# EAGLE design Serial Card V2 (EAGLE 6.5.0)
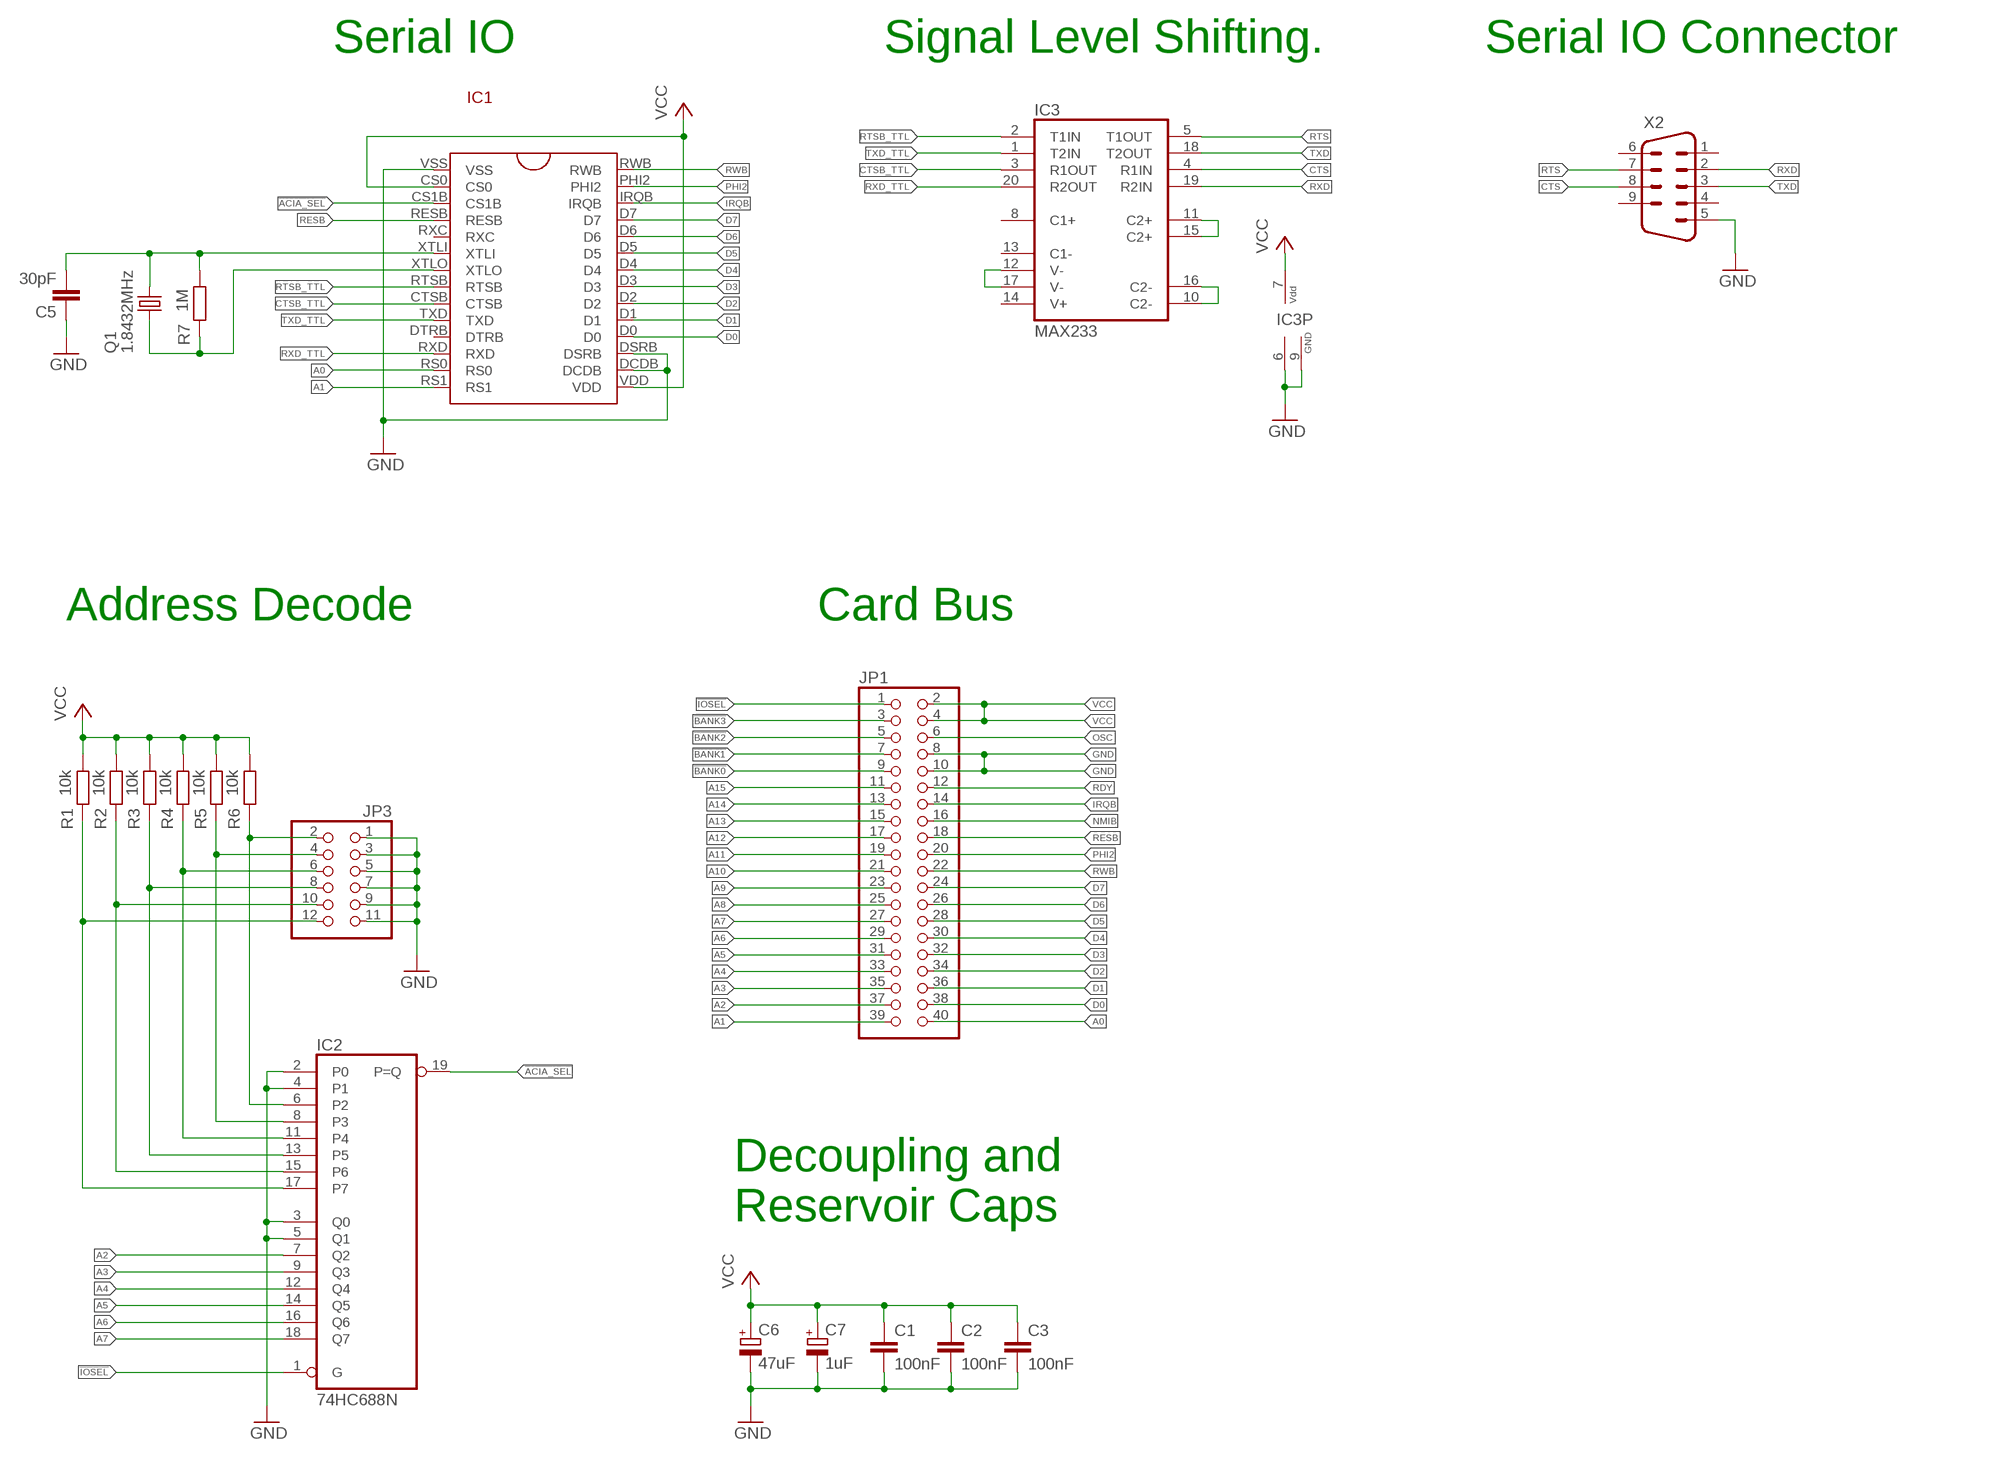
[diagram p0: schematic, sheet 1]

## Parts
C1  100nF  C-EU050-025X075  [C050-025X075]
C2  100nF  C-EU050-025X075  [C050-025X075]
C3  100nF  C-EU050-025X075  [C050-025X075]
C5  30pF  C-EU050-025X075  [C050-025X075]
C6  47uF  CPOL-EUE2.5-7  [E2,5-7]
C7  1uF  CPOL-EUE2.5-5  [E2,5-5]
IC1  W65C51N-DIP  [W65C51N-DIP]
IC2  74HC688N  [DIL20]
IC3  MAX233  [DIL20]
JP1  PINHD-2X20/90  [2X20/90]
JP3  PINHD-2X6  [2X06]
Q1  1.8432MHz  CRYSTALHC49S  [HC49/S]
R1  10k  R-EU_0207/2V  [0207/2V]
R2  10k  R-EU_0207/2V  [0207/2V]
R3  10k  R-EU_0207/2V  [0207/2V]
R4  10k  R-EU_0207/2V  [0207/2V]
R5  10k  R-EU_0207/2V  [0207/2V]
R6  10k  R-EU_0207/2V  [0207/2V]
R7  1M  R-EU_0207/2V  [0207/2V]
X2  M09HP  [M09HP]

## Nets
!ACIA_SEL: IC1.CS1B IC2.19(P=Q)
!BANK0: JP1.9
!BANK1: JP1.7
!BANK2: JP1.5
!BANK3: JP1.3
!IOSEL: IC2.1(G) JP1.1
A0: IC1.RS0 JP1.40
A1: IC1.RS1 JP1.39
A2: IC2.7(Q2) JP1.37
A3: IC2.9(Q3) JP1.35
A4: IC2.12(Q4) JP1.33
A5: IC2.14(Q5) JP1.31
A6: IC2.16(Q6) JP1.29
A7: IC2.18(Q7) JP1.27
A8: JP1.25
A9: JP1.23
A10: JP1.21
A11: JP1.19
A12: JP1.17
A13: JP1.15
A14: JP1.13
A15: JP1.11
CTS: IC3.4(R1IN) X2.8
CTSB_TTL: IC1.CTSB IC3.3(R1OUT)
D0: IC1.D0 JP1.38
D1: IC1.D1 JP1.36
D2: IC1.D2 JP1.34
D3: IC1.D3 JP1.32
D4: IC1.D4 JP1.30
D5: IC1.D5 JP1.28
D6: IC1.D6 JP1.26
D7: IC1.D7 JP1.24
GND: C1.2 C2.2 C3.2 C5.1 C6.- C7.- IC1.DCDB IC1.DSRB IC1.VSS IC2.2(P0) IC2.3(Q0) IC2.4(P1) IC2.5(Q1) IC3.6(GND) IC3.9(GND) JP1.8 JP1.10 JP3.1 JP3.3 JP3.5 JP3.7 JP3.9 JP3.11 X2.5
IRQB: IC1.IRQB JP1.14
N$1: C5.2 IC1.XTLI Q1.2 R7.2
N$2: IC1.XTLO Q1.1 R7.1
N$5: IC3.12(V-) IC3.17(V-)
N$8: IC3.11(C2+) IC3.15(C2+)
N$9: IC3.10(C2-) IC3.16(C2-)
NMIB: JP1.16
OSC: JP1.6
P2: IC2.6(P2) JP3.2 R6.1
P3: IC2.8(P3) JP3.4 R5.1
P4: IC2.11(P4) JP3.6 R4.1
P5: IC2.13(P5) JP3.8 R3.1
P6: IC2.15(P6) JP3.10 R2.1
P7: IC2.17(P7) JP3.12 R1.1
PHI2: IC1.PHI2 JP1.20
RDY: JP1.12
RESB: IC1.RESB JP1.18
RTS: IC3.5(T1OUT) X2.7
RTSB_TTL: IC1.RTSB IC3.2(T1IN)
RWB: IC1.RWB JP1.22
RXD: IC3.19(R2IN) X2.2
RXD_TTL: IC1.RXD IC3.20(R2OUT)
TXD: IC3.18(T2OUT) X2.3
TXD_TTL: IC1.TXD IC3.1(T2IN)
VCC: C1.1 C2.1 C3.1 C6.+ C7.+ IC1.CS0 IC1.VDD IC3.7(VDD) JP1.2 JP1.4 R1.2 R2.2 R3.2 R4.2 R5.2 R6.2
Unconnected: IC1.DTRB IC1.RXC IC3.8(C1+) IC3.13(C1-) IC3.14(V+) X2.1 X2.4 X2.6 X2.9

## Notes on the sheet
- Serial IO | Signal Level Shifting. | Serial IO Connector
- Address Decode | Card Bus
- Decoupling and
  Reservoir Caps

## Power pins joined to a net without a drawn wire
GND: IC2.10(GND)
VCC: IC2.20(VCC)

## Library data of the parts
C1-C3 C5 = rcl:C-EU: CAPACITOR, European symbol
C6 C7 = rcl:CPOL-EU: POLARIZED CAPACITOR, European symbol
IC1 = WDC-parts:W65C51N-DIP: Asynchronous Communications Interface Adaptor.
IC2 = 74xx-eu:74*688: 8-bit MAGNITUDE/IDENTITY COMPARATOR, totem pole
IC3 = maxim:MAX233: RS232 TRANSEIVER
JP1 = pinhead:PINHD-2X20: PIN HEADER
JP3 = pinhead:PINHD-2X6: PIN HEADER
Q1 = crystal:CRYSTAL: CRYSTAL; OC_FARNELL: 1667008; OC_NEWARK: unknown
R1-R7 = rcl:R-EU_: RESISTOR, European symbol
X2 = con-subd:M09: SUB-D; OC_FARNELL: unknown; OC_NEWARK: unknown

## Board
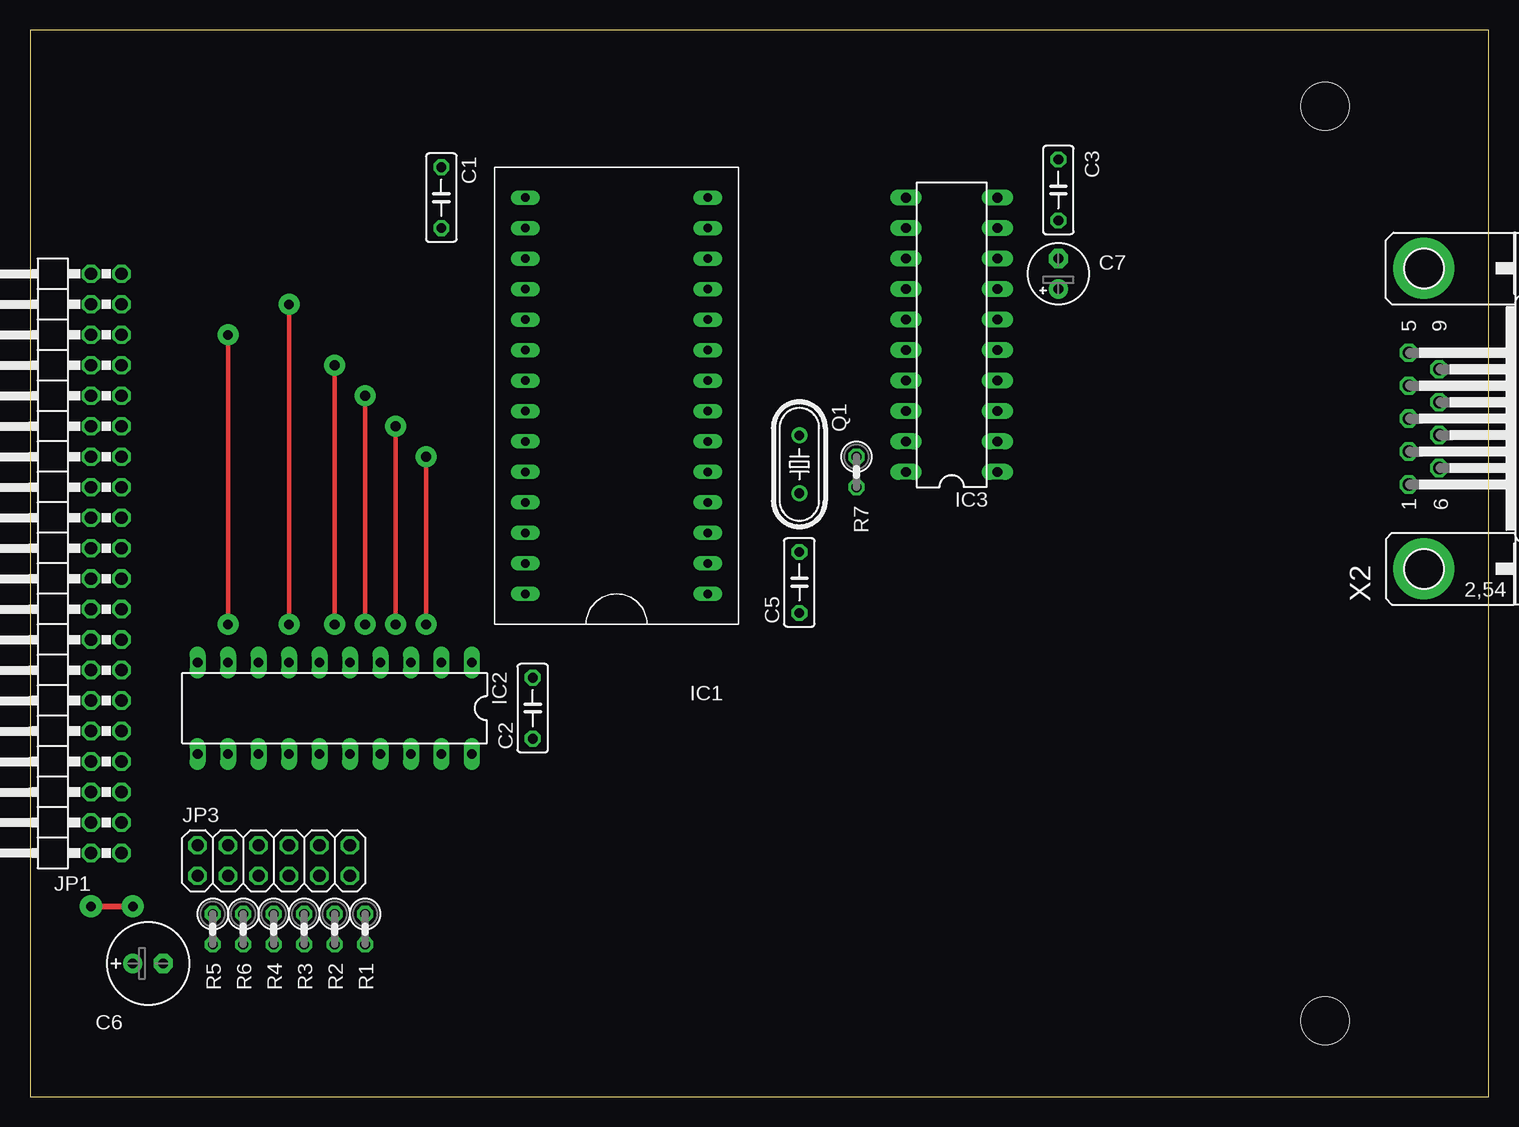
[diagram p1: board, top side]
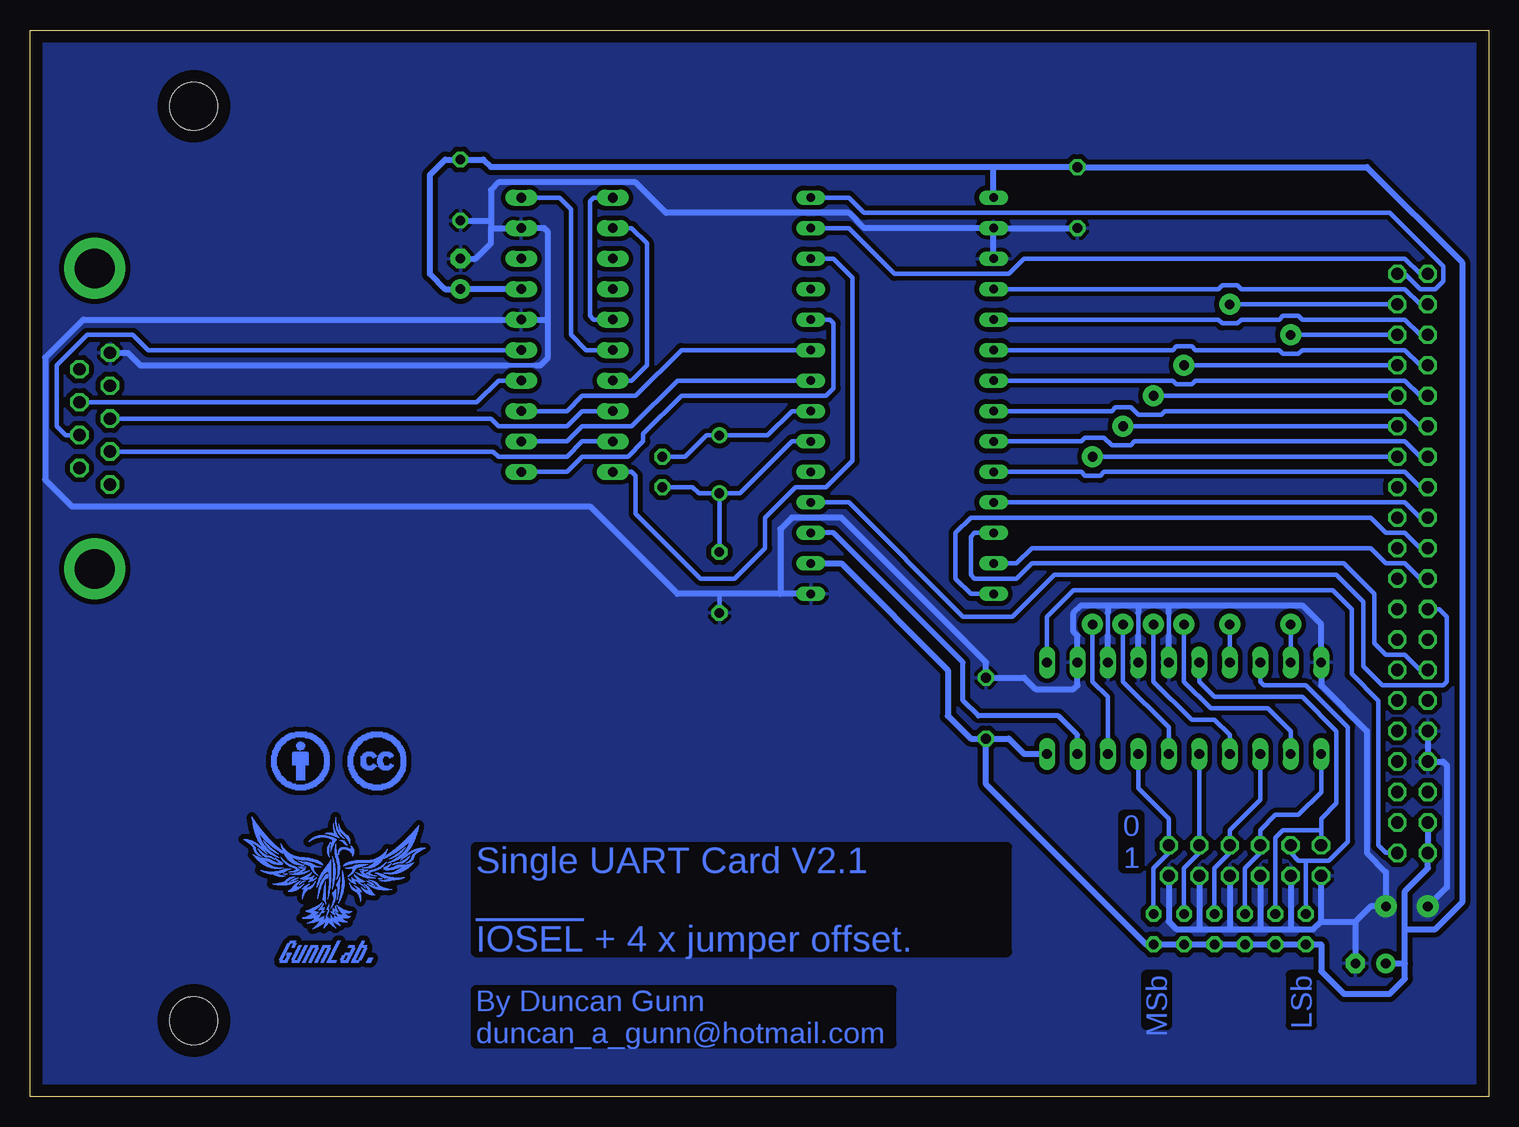
[diagram p2: board, bottom side, seen from below]

Size 121.6 x 88.9 mm. Coordinates in mm from the lower left corner, seen from the top.
Outline: 121.59,0 0,0 0,88.89 121.59,88.89
Outline: 121.6,0 121.6,88.9
Copper layers (1*16): Top 0.035mm / dielectric 1.5mm / Bottom 0.035mm
Design rules "default *": minimum track width 10mil, minimum drill 24mil, track to track 8mil, track to pad 8mil, pad to pad 8mil, via to via 8mil, smd to smd 8mil, copper to edge 40mil, drill to drill 8mil, minimum pad ring 10mil, minimum via ring 8mil, stop-mask expansion 4mil, vias tented up to drill 0mil, thermal gap 12mil
Holes 4 mm at 107.95,82.55 107.95,6.35

### Footprints (pad centres in the part's own frame; a part is rotated, then mirrored left to right if it is on the bottom)
C050-025X075 = drill 0.813 octagon: 1 -2.54,0; 2 2.54,0
E2,5-7 = drill 0.813 pad 1.6: + -1.27,0 | drill 0.813 pad 1.6 octagon: - 1.27,0
E2,5-5 = drill 0.813 pad 1.6: + -1.27,0 | drill 0.813 pad 1.6 octagon: - 1.27,0
W65C51N-DIP = drill 0.7 long: CS0 -7.62,13.97; CS1B -7.62,11.43; CTSB -7.62,-3.81; D0 7.62,-8.89; D1 7.62,-6.35; D2 7.62,-3.81; D3 7.62,-1.27; D4 7.62,1.27; D5 7.62,3.81; D6 7.62,6.35; D7 7.62,8.89; DCDB 7.62,-13.97; DSRB 7.62,-11.43; DTRB -7.62,-8.89; IRQB 7.62,11.43; PHI2 7.62,13.97; RESB -7.62,8.89; RS0 -7.62,-13.97; RS1 -7.62,-16.51; RTSB -7.62,-1.27; RWB 7.62,16.51; RXC -7.62,6.35; RXD -7.62,-11.43; TXD -7.62,-6.35; VDD 7.62,-16.51; VSS -7.62,16.51; XTLI -7.62,3.81; XTLO -7.62,1.27
DIL20 = drill 0.813 long: 1 -11.43,-3.81; 2 -8.89,-3.81; 3 -6.35,-3.81; 4 -3.81,-3.81; 5 -1.27,-3.81; 6 1.27,-3.81; 7 3.81,-3.81; 8 6.35,-3.81; 9 8.89,-3.81; 10 11.43,-3.81; 11 11.43,3.81; 12 8.89,3.81; 13 6.35,3.81; 14 3.81,3.81; 15 1.27,3.81; 16 -1.27,3.81; 17 -3.81,3.81; 18 -6.35,3.81; 19 -8.89,3.81; 20 -11.43,3.81
2X20/90 = drill 1.016 octagon: 1 -24.13,-6.35; 2 -24.13,-3.81; 3 -21.59,-6.35; 4 -21.59,-3.81; 5 -19.05,-6.35; 6 -19.05,-3.81; 7 -16.51,-6.35; 8 -16.51,-3.81; 9 -13.97,-6.35; 10 -13.97,-3.81; 11 -11.43,-6.35; 12 -11.43,-3.81; 13 -8.89,-6.35; 14 -8.89,-3.81; 15 -6.35,-6.35; 16 -6.35,-3.81; 17 -3.81,-6.35; 18 -3.81,-3.81; 19 -1.27,-6.35; 20 -1.27,-3.81; 21 1.27,-6.35; 22 1.27,-3.81; 23 3.81,-6.35; 24 3.81,-3.81; 25 6.35,-6.35; 26 6.35,-3.81; 27 8.89,-6.35; 28 8.89,-3.81; 29 11.43,-6.35; 30 11.43,-3.81; 31 13.97,-6.35; 32 13.97,-3.81; 33 16.51,-6.35; 34 16.51,-3.81; 35 19.05,-6.35; 36 19.05,-3.81; 37 21.59,-6.35; 38 21.59,-3.81; 39 24.13,-6.35; 40 24.13,-3.81
2X06 = drill 1.016 octagon: 1 -6.35,-1.27; 2 -6.35,1.27; 3 -3.81,-1.27; 4 -3.81,1.27; 5 -1.27,-1.27; 6 -1.27,1.27; 7 1.27,-1.27; 8 1.27,1.27; 9 3.81,-1.27; 10 3.81,1.27; 11 6.35,-1.27; 12 6.35,1.27
HC49/S = drill 0.813: 1 -2.413,0; 2 2.413,0
0207/2V = drill 0.813 octagon: 1 -1.27,0; 2 1.27,0
M09HP = drill 1.016 octagon: 1 -5.486,1.27; 2 -2.743,1.27; 3 0,1.27; 4 2.743,1.27; 5 5.486,1.27; 6 -4.115,-1.27; 7 -1.372,-1.27; 8 1.372,-1.27; 9 4.115,-1.27 | drill 3.302 pad 5.08: G1 -12.522,0; G2 12.522,0

### Placement (x,y rotation side)
C1  34.29,74.93 270 top
C2  41.91,32.38 90 top
C3  85.72,75.56 270 top
C5  64.14,42.86 90 top
C6  9.84,11.11 0 top
C7  85.72,68.58 90 top
IC1  48.9,58.42 180 top
IC2  25.4,32.38 180 top
IC3  76.83,63.5 90 top
JP1  1.27,44.45 90 top
JP3  20.32,19.68 0 top
Q1  64.14,52.7 270 top
R1  27.94,13.97 270 top
R2  25.4,13.97 270 top
R3  22.86,13.97 270 top
R4  20.32,13.97 270 top
R5  15.24,13.97 270 top
R6  17.78,13.97 270 top
R7  68.9,52.07 270 top
U$1  [LIONTECH]  96.52,17.78 0 top
U$2  [BY]  99.06,27.94 0 top
U$3  [CC]  92.71,27.94 180 top
X2  116.2,56.52 90 top

### Tracks (layer width: path | path; a pad name or v marks a point on that pad's centre or on a via)
!ACIA_SEL
  Bottom 0.406: IC2.19 34.29,30.16 35.88,31.75 42.55,31.75 43.81,33.02 43.81,36.2 54.61,46.99 IC1.CS1B
!IOSEL
  Bottom 0.356: IC2.1 36.83,40.01 34.61,42.23 13.02,42.23 11.43,40.64 11.43,35.24 9.21,33.02 9.21,20.95 8.57,20.32 JP1.1
A0
  Bottom 0.356: JP1.40 5.71,68.58 6.99,69.85 38.73,69.85 40.01,68.58 49.53,68.58 53.34,72.39 IC1.RS0
A1
  Bottom 0.356: JP1.39 6.99,68.58 5.71,67.31 4.45,67.31 3.81,67.94 3.81,69.22 8.26,73.66 52.07,73.66 53.34,74.93 IC1.RS1
A2  (via drill 0.8 pad 1.75)
  Top 0.356: v21.59,39.37 v21.59,66.04
  Bottom 0.356: IC2.7 v21.59,39.37 | v21.59,66.04 JP1.37
A3  (via drill 0.8 pad 1.75)
  Top 0.356: v16.51,39.37 v16.51,63.5
  Bottom 0.356: IC2.9 v16.51,39.37 | v16.51,63.5 JP1.35
A4  (via drill 0.8 pad 1.75)
  Top 0.356: v25.4,39.37 v25.4,60.96
  Bottom 0.356: IC2.12 16.51,30.48 18.41,32.38 23.18,32.38 25.4,34.61 v25.4,39.37 | v25.4,60.96 JP1.33
A5  (via drill 0.8 pad 1.75)
  Top 0.356: v27.94,39.37 v27.94,58.42
  Bottom 0.356: IC2.14 21.59,30.16 22.86,31.43 24.77,31.43 27.94,34.61 v27.94,39.37 | v27.94,58.42 JP1.31
A6  (via drill 0.8 pad 1.75)
  Top 0.356: v30.48,39.37 v30.48,55.88
  Bottom 0.356: IC2.16 26.67,30.8 30.48,34.61 v30.48,39.37 | v30.48,55.88 JP1.29
A7  (via drill 0.8 pad 1.75)
  Top 0.356: v33.02,39.37 v33.02,53.34
  Bottom 0.356: IC2.18 31.75,33.34 33.02,34.61 v33.02,39.37 | v33.02,53.34 JP1.27
CTS
  Bottom 0.356: X2.8 84.35,57.89 82.55,59.69 IC3.4
CTSB_TTL
  Bottom 0.356: IC3.3 76.83,57.15 75.56,58.42 71.12,58.42 67.31,62.23 IC1.CTSB
D0
  Bottom 0.356: JP1.38 5.71,66.04 6.99,67.31 20.64,67.31 20.95,67.63 22.23,67.63 22.54,67.31 IC1.D0
D1
  Bottom 0.356: JP1.36 5.71,63.5 6.99,64.77 15.56,64.77 15.88,65.09 17.14,65.09 17.46,64.77 20.64,64.77 20.95,64.45 22.23,64.45 22.54,64.77 IC1.D1
D2
  Bottom 0.356: JP1.34 5.71,60.96 6.99,62.23 15.56,62.23 15.88,61.91 17.14,61.91 17.46,62.23 24.45,62.23 24.77,62.55 26.04,62.55 26.35,62.23 IC1.D2
D3
  Bottom 0.356: JP1.32 5.71,58.42 6.99,59.69 24.45,59.69 24.77,59.37 26.04,59.37 26.35,59.69 IC1.D3
D4
  Bottom 0.356: JP1.30 5.71,55.88 6.99,57.15 26.99,57.15 27.3,56.83 29.21,56.83 29.84,57.47 31.11,57.47 31.43,57.15 IC1.D4
D5
  Bottom 0.356: JP1.28 5.71,53.34 6.99,54.61 29.53,54.61 29.84,54.29 31.43,54.29 32.07,54.93 33.66,54.93 33.97,54.61 IC1.D5
D6
  Bottom 0.356: JP1.26 5.71,50.8 6.99,52.07 32.07,52.07 32.38,51.75 33.66,51.75 33.97,52.07 IC1.D6
D7
  Bottom 0.356: JP1.24 5.71,48.26 6.99,49.53 IC1.D7
GND  (via drill 0.8 pad 1.85)
  Top 0.508: v5.08,15.88 v8.57,15.88
  Bottom 0.356: 26.67,38.42 26.67,40.32 | 31.75,38.42 31.75,40.32 | 29.21,38.42 29.21,40.32 | 81.92,60.96 79.38,60.96 | C5.1 64.14,41.91
  Bottom 0.508: IC1.DSRB IC1.DCDB | IC1.DCDB 52.07,72.39 53.34,73.66 68.58,73.66 71.12,76.2 82.55,76.2 83.19,75.56 83.19,73.03 | 83.19,73.03 83.19,72.39 | 83.19,72.39 IC3.9 78.74,72.39 78.42,72.07 78.42,64.77 | JP3.11 26.67,14.61 26.04,13.97 24.13,13.97 | 24.13,13.97 21.59,13.97 | 21.59,13.97 19.05,13.97 | 19.05,13.97 16.51,13.97 | 16.51,13.97 14.61,13.97 13.97,14.61 | 13.97,14.61 JP3.1 | JP3.3 16.51,13.97 | JP3.5 19.05,13.97 | JP3.7 21.59,13.97 | JP3.9 24.13,13.97 | JP1.10 JP1.8 3.81,27.94 3.49,27.62 3.49,17.46 v5.08,15.88 | 31.75,40.96 33.97,40.96 34.61,40.32 34.61,38.73 34.29,38.42 IC2.2 34.29,34.29 34.61,33.97 37.78,33.97 38.73,34.92 C2.2 41.91,36.2 53.98,48.26 58.1,48.26 59.05,47.31 59.05,41.91 | 31.75,40.96 29.21,40.96 | 29.21,40.96 26.67,40.96 | 26.67,40.96 15.56,40.96 13.97,39.37 IC2.10 13.97,34.29 10.16,30.48 10.16,20.32 8.57,18.73 v8.57,15.88 9.84,15.88 11.11,14.61 | IC2.5 26.67,38.42 | 26.67,40.32 26.67,40.96 | IC2.3 31.75,38.42 | IC2.4 29.21,38.42 | 29.21,40.96 29.21,40.32 | 31.75,40.96 31.75,40.32 | C7.- 84.45,69.85 83.19,71.12 83.19,72.39 | IC1.DCDB C1.2 | C3.2 83.19,73.03 | IC1.VSS 59.05,41.91 | 59.05,41.91 64.14,41.91 67.63,41.91 74.93,49.21 118.11,49.21 120.33,51.44 120.33,61.59 117.16,64.77 IC3.6 78.42,64.77 | X2.5 113.44,62 112.39,60.96 81.92,60.96 | 79.38,60.96 79.06,60.96 78.42,61.59 78.42,64.77 | 11.11,14.61 C6.- | 13.97,14.61 11.11,14.61
  pour Bottom (isolate 0.406): 0,88.9 121.6,88.9 121.6,0 0,0
IRQB
  Bottom 0.356: IC1.IRQB 42.86,46.99 43.18,46.67 43.18,43.5 42.86,43.18 39.37,43.18 38.1,44.45 12.06,44.45 9.53,41.91 9.53,37.78 8.57,36.83 6.99,36.83 5.71,35.56 JP1.14
N$1
  Bottom 0.356: IC1.XTLI 58.1,54.61 62.42,50.29 Q1.2 | R7.2 66.36,50.8 65.85,50.29 Q1.2 | Q1.2 C5.2
N$2
  Bottom 0.356: IC1.XTLO 58.1,57.15 60.13,55.12 Q1.1 65.22,55.12 66.99,53.34 R7.1
N$5
  Bottom 0.356: IC3.12 71.44,72.39 70.17,71.12 70.17,60.96 71.44,59.69 IC3.17
N$8
  Bottom 0.356: IC3.11 74.61,74.93 74.93,74.61 74.93,65.09 74.61,64.77 IC3.15
N$9
  Bottom 0.356: IC3.16 75.25,62.23 76.52,63.5 76.52,73.98 77.47,74.93 IC3.10
P2
  Bottom 0.356: JP3.2 13.97,22.23 | IC2.6 24.13,34.61 22.86,33.34 15.56,33.34 12.7,30.48 12.7,24.45 13.97,23.18 13.97,22.23 | R6.1 17.78,21.59 17.14,22.23 13.97,22.23
P3
  Bottom 0.356: JP3.4 16.51,20.32 15.88,19.68 15.24,19.68 | 15.24,19.68 13.34,19.68 11.75,21.27 11.75,30.8 15.24,34.29 18.73,34.29 19.05,34.61 IC2.8 | R5.1 15.24,19.68
P4
  Bottom 0.356: R4.1 20.32,19.05 19.05,20.32 JP3.6 19.05,22.23 17.78,23.5 15.88,23.5 13.97,25.4 IC2.11
P5
  Bottom 0.356: R3.1 22.86,19.05 21.59,20.32 JP3.8 21.59,22.23 19.05,24.77 IC2.13
P6
  Bottom 0.356: IC2.15 JP3.10 24.13,20.32 25.4,19.05 R2.1
P7
  Bottom 0.356: IC2.17 29.21,25.72 26.67,23.18 JP3.12 26.67,20.32 27.94,19.05 R1.1
PHI2
  Bottom 0.356: JP1.20 5.71,43.18 6.99,44.45 8.57,44.45 9.84,45.72 38.1,45.72 39.37,44.45 IC1.PHI2
RESB
  Bottom 0.356: JP1.18 4.13,40.64 3.49,40.01 3.49,34.61 3.81,34.29 8.89,34.29 10.48,35.88 10.48,41.27 12.7,43.5 36.2,43.5 39.69,40.01 43.81,40.01 53.34,49.53 IC1.RESB
RTS
  Bottom 0.356: X2.7 118.64,55.14 119.38,55.88 119.38,60.96 116.84,63.5 113.03,63.5 111.76,62.23 IC3.5
RTSB_TTL
  Bottom 0.356: IC3.2 76.83,54.61 75.56,55.88 71.44,55.88 67.63,59.69 IC1.RTSB
RWB
  Bottom 0.356: JP1.22 5.71,45.72 6.99,46.99 8.57,46.99 9.84,48.26 43.18,48.26 44.45,46.99 44.45,43.18 43.18,41.91 IC1.RWB
RXD
  Bottom 0.356: IC3.19 75.56,54.61 76.83,53.34 82.55,53.34 82.98,53.77 X2.2
RXD_TTL
  Bottom 0.356: IC3.20 71.44,52.07 71.12,51.75 71.12,48.58 65.72,43.18 62.87,43.18 60.33,45.72 60.33,48.26 57.78,50.8 55.24,50.8 53.02,53.02 53.02,68.26 54.61,69.85 IC1.RXD
TXD
  Bottom 0.356: IC3.18 75.56,57.15 76.83,55.88 82.55,55.88 83.19,56.52 X2.3
TXD_TTL
  Bottom 0.356: IC3.1 76.83,52.07 75.56,53.34 71.75,53.34 70.48,54.61 70.48,55.24 67.31,58.42 55.24,58.42 54.61,59.05 54.61,64.45 54.93,64.77 IC1.TXD
VCC
  Bottom 0.508: JP1.4 JP1.2 5.08,19.05 6.99,17.14 6.99,13.97 | IC3.7 C7.+ 87,67.31 88.27,68.58 88.27,76.83 87,78.11 C3.1 83.82,78.11 83.19,77.47 41.27,77.47 | IC1.VDD 41.27,77.47 | C2.1 40.01,29.84 38.73,28.57 IC2.20 | C2.1 41.91,26.04 28.57,12.7 R1.2 R2.2 R3.2 R4.2 R6.2 R5.2 13.97,12.7 13.97,10.48 12.06,8.57 8.26,8.57 6.99,9.84 6.99,11.11 | 41.27,77.47 C1.1 10.16,77.47 2.22,69.53 2.22,16.19 4.45,13.97 6.99,13.97 | IC1.CS0 53.98,44.45 45.09,35.56 45.09,31.75 43.18,29.84 C2.1 | C6.+ 6.99,11.11 | 6.99,11.11 6.99,13.97

### Text on the board
Bottom: 0 / 1 | Single UART Card V2.1 / / !IOSEL! + 4 x jumper offset. | LSb | MSb | By Duncan Gunn / duncan_a_gunn@hotmail.com